# Altium schematic sheet Main.SchDoc
size 152 x 50 mm; PageSetup: Record=PageOptions|CenterHorizontal=True|CenterVertical=True|PrintScale=0.71|XCorrection=1.00|YCorrection=1.00|PrintKind=1|BorderSize=5000000|LeftOffset=0|BottomOffset=0|Orientation=2|PaperLength=1000|PaperWidth=1000|Scale=100|PaperSource=15|PrintQuality=4000|MediaType=1|DitherType=10|PrintScaleMode=1|PaperKind=A4|PaperIndex=9
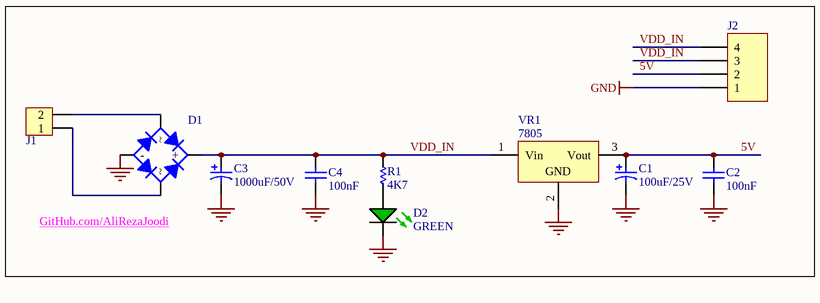
[diagram p0: Main.SchDoc]

## Parts
C1  100uF/25V  [C_THD_EL_(P3.4-D8-H7)]
C2  100nF  [C_THD_CER_(P2.54-D3.5-T1.5)]
C3  1000uF/50V  [C_THD_EL_(P3.4-D8-H7)]
C4  100nF  [C_THD_CER_(P2.54-D3.5-T1.5)]
D1  Bridge1  [BRIDGE-1]  (value not drawn)
D2  GREEN  [LED_THD_5MM_GREEN]
J1  2PIN  [Connector_Phoenix_2PIN_MSTB]  (value not drawn)
J2  4Pin  [HDR1X4]  (value not drawn)
R1  4K7  [R_THD_AXIAL0.4(1/4W)]
VR1  7805  [TO220_3PIN_V]

## Nets
GND: C1.2 C2.2 C3.2 C4.2 D1.1(-) D2.2(K) J2.1 VR1.2(GND)
5V: C1.1 C2.1 J2.2 VR1.3(Vout)
VDD_IN: C3.1 C4.1 D1.3(+) J2.3 J2.4 R1.2 VR1.1(Vin)
NetD1_2: D1.2 J1.2
NetD1_4: D1.4 J1.1
NetD2_1: D2.1(A) R1.1

## Notes on the sheet
- GitHub.com/AliRezaJoodi

## Library data of the parts
C1 C3 = Capacitor_Electrolytic: Capacitor, Electrolytic; Revision: July-2002: Re-released for DXP Platform.
C2 C4 = Capacitor_Ceramic: Capacitor, Ceramic Multilayer; Revision: July-2002: Re-released for DXP Platform.
D1 = Bridge1: Full Wave Diode Bridge; Manufacturer: Generic Components; Class I: Discrete; Class II: Rectifier - Bridge; Published: 8-Jun-2000; Revision: July-2002: Re-released for DXP Platform.; Publisher: Altium Limited
D2 = LED_GREEN: LED, Green; Manufacturer: Generic Components; Class I: Optoelectronic; Published: 8-Jun-2000; Revision: July-2002: Re-released for DXP Platform.; Publisher: Altium Limited; Class II: LED
J1 = Connector_Header_2Pin: Connector, Header, 2Pin; Revision: July-2002: Re-released for DXP Platform.
J2 = Header 4: Header, 4-Pin; Manufacturer: Generic Components; Class I: Connector; Revision: July-2002: Re-released for DXP Platform.; Publisher: Altium Limited
R1 = Resistor: Revision: July-2002: Re-released for DXP Platform.
VR1 = Volt Reg: Voltage Regulator, Linear, Fixed, 5v, 1.5A; Revision: July-2002: Re-released for DXP Platform.